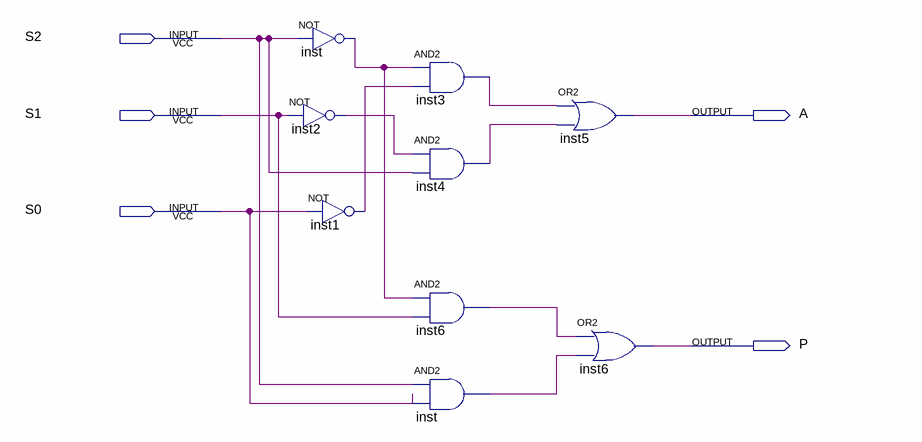
[diagram p0: schematic sheet]
// Quartus schematic lab5.bdf as structural Verilog: 9 symbols, 5 pins
module lab5 (
  input  S2,
  input  S1,
  input  S0,
  output A,
  output P
);

  wire inst1_out, inst2_out, inst3_out, inst4_out, inst6_out, inst_out, inst_out_2;

  not inst (inst_out, S2);
  not inst2 (inst2_out, S1);
  not inst1 (inst1_out, S0);
  and inst3 (inst3_out, inst_out, inst1_out);
  and inst4 (inst4_out, inst2_out, S2);
  and inst6 (inst6_out, inst_out, S1);
  and inst_dup2 (inst_out_2, S2, S0);
  or inst5 (A, inst3_out, inst4_out);
  or inst6_dup2 (P, inst6_out, inst_out_2);
endmodule
